# Altium project nnts.PrjPcb (part 2 of 3)

## Sheet USB.SchDoc: USB
size B; Revision: 1
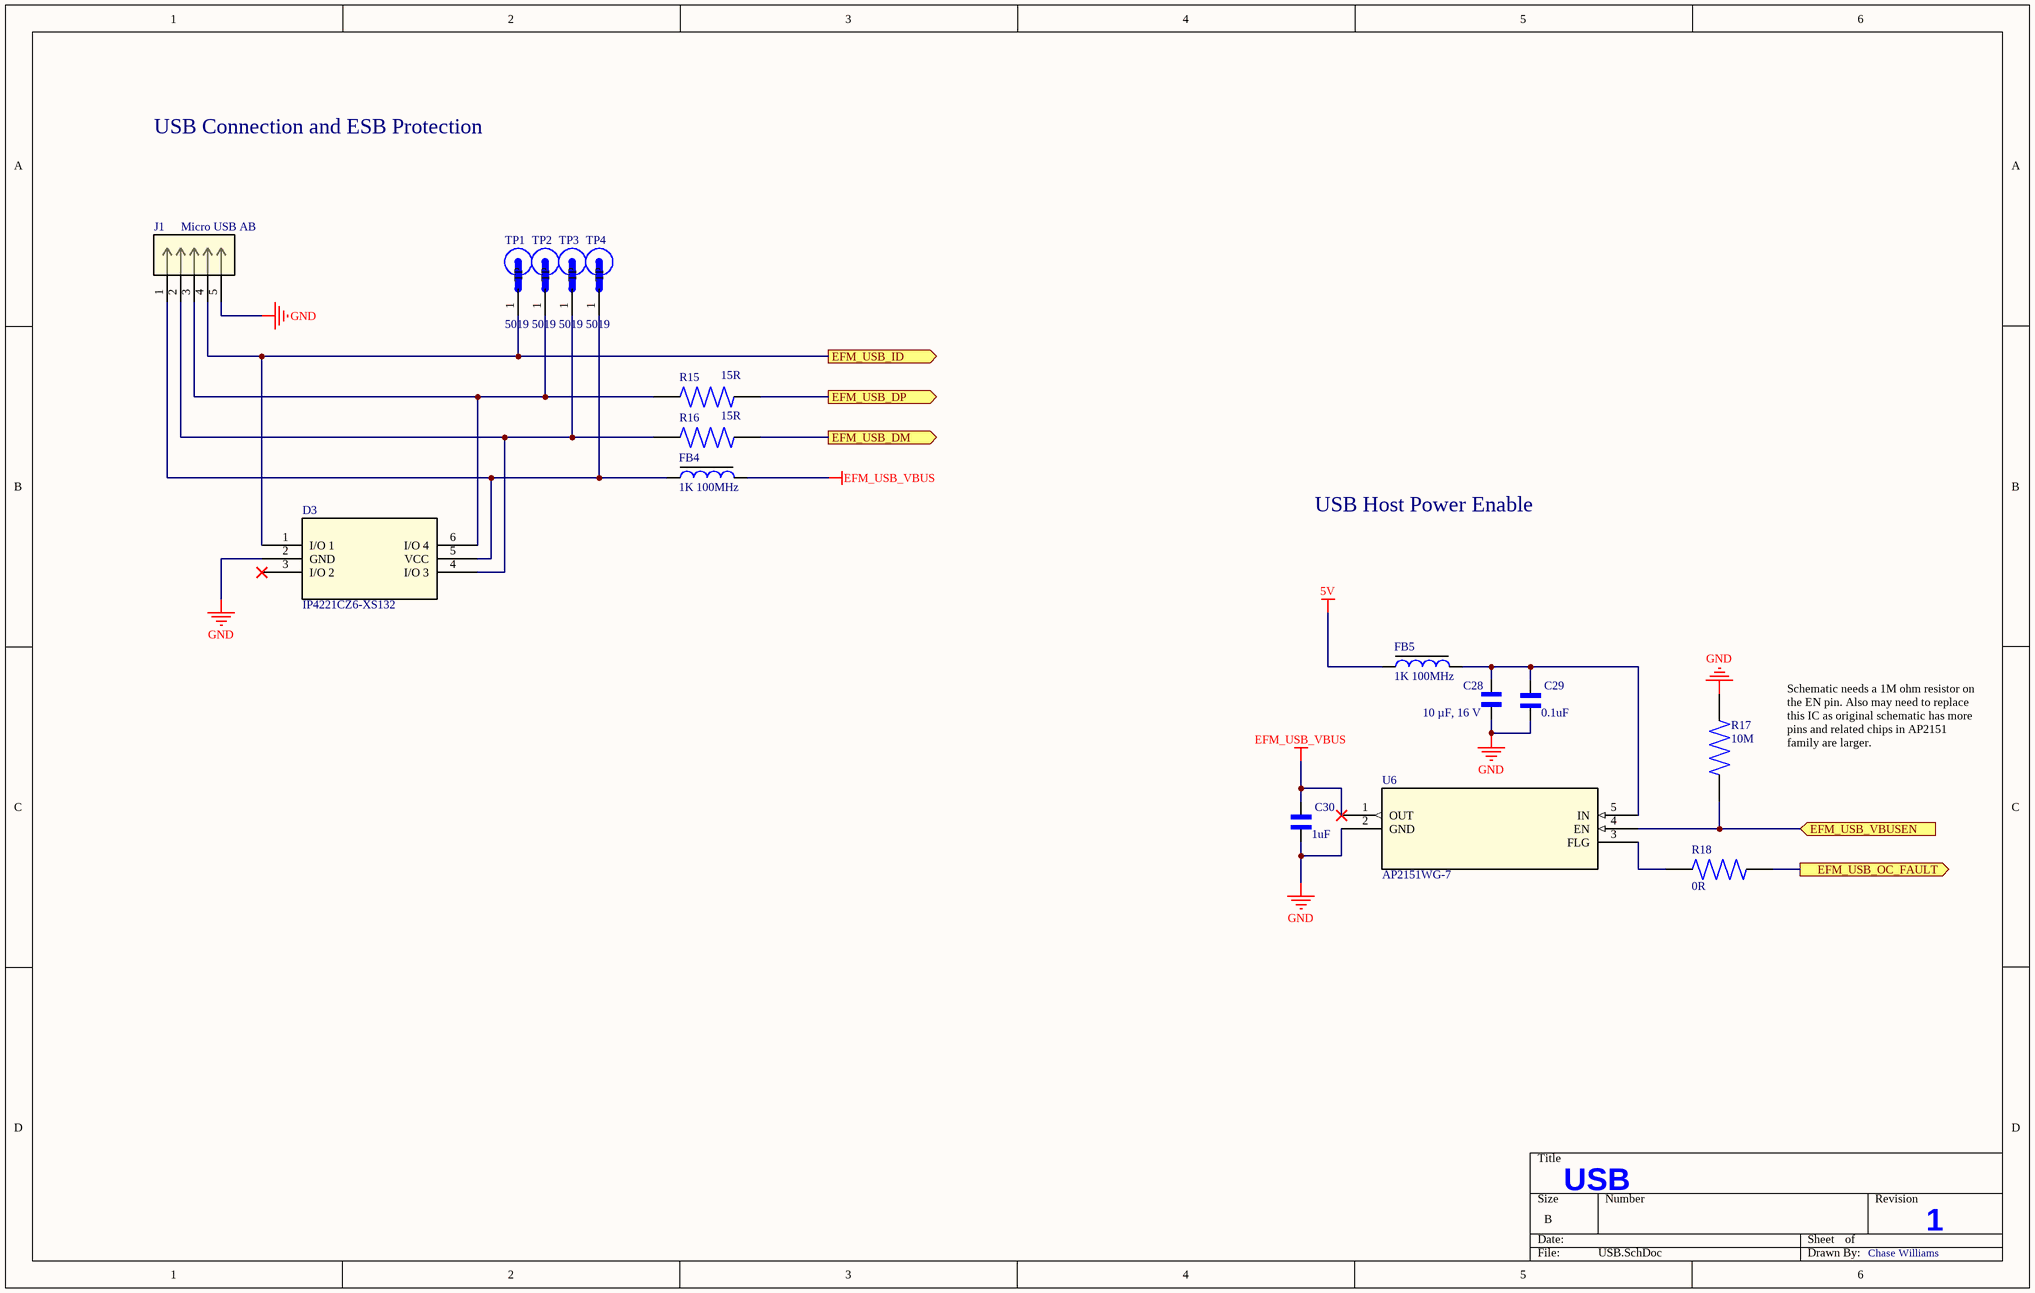
[diagram p5: USB.SchDoc]

### Parts
C28  10 µF, 16 V  [C0805]
C29  0.1uF  [C0402]
C30  1uF  [C0603]
D3  IP4221CZ6-XS132  [SOT886_NEX-M]
FB4  1K 100MHz  [FB0603]
FB5  1K 100MHz  [FB0603]
J1  Micro USB AB  [Molex Micro USB]
R15  15R  [R0402 Vishay]
R16  15R  [R0402 Vishay]
R17  10M  [R0402 Vishay]
R18  0R  [R0805 Yageo]
TP1  5019  [TP380X203]
TP2  5019  [TP380X203]
TP3  5019  [TP380X203]
TP4  5019  [TP380X203]
U6  AP2151WG-7  [AP2151FMG-7]

### Ports
EFM_USB_DM (out), EFM_USB_DP (out), EFM_USB_ID (out), EFM_USB_OC_FAULT (out), EFM_USB_VBUSEN (in)

### Nets
5V: FB5.1
EFM_USB_VBUS: C30.2 FB4.2 U6.1(OUT)  [project net EFM_BUS]
GND: C28.2 C29.1 C30.1 D3.2(GND) J1.5(GND) R17.2 U6.2(GND)
NetC28_1: C28.1 C29.2 FB5.2 U6.5(IN)
NetD3_1: D3.1(I/O_1) J1.4(ID) TP1.1(TP) ; port EFM_USB_ID
NetD3_4: D3.4(I/O_3) J1.2(D-) R16.1 TP3.1(TP)
NetD3_5: D3.5(VCC) FB4.1 J1.1(VBUS) TP4.1(TP)
NetD3_6: D3.6(I/O_4) J1.3(D+) R15.1 TP2.1(TP)
NetR15_2: R15.2 ; port EFM_USB_DP
NetR16_2: R16.2 ; port EFM_USB_DM
NetR17_1: R17.1 U6.4(EN) ; port EFM_USB_VBUSEN
NetR18_1: R18.1 U6.3(FLG)
NetR18_2: R18.2 ; port EFM_USB_OC_FAULT

Not connected (* = marked no-connect by the designer): D3 3(I/O_2)*

### Notes on the sheet
- USB Connection and ESB Protection
- USB Host Power Enable
- Schematic needs a 1M ohm resistor on the EN pin. Also may need to replace this IC as original schematic has more pins and related chips in AP2151 family are larger.
- Chase Williams

### Library data of the parts
C28 = C2012X5R1C106K085AC: TDK - C2012X5R1C106K085AC - SMD Multilayer Ceramic Capacitor, 10 µF, 16 V, 0805 [2012 Metric], ± 10%, X5R, C Series TDK; Capacitance: 10uF; Voltage Rating: 16V; Supplier 1: Digi-Key; Manufacturer: TDK; Manufacturer Part Number: C2012X5R1C106K085AC; RoHS: Yes; Category: Ceramic Capacitors; Stock 1: 1442350; Pricing 1: 1=0.25000, 10=0.17500, 100=0.09890, 500=0.06982, 1000=0.06110 (USD); Mount: Surface Mount; Case/Package: 0805; Number of Pins: 2; Weight: 0.000194oz; Case Code (Metric): 2012; Case Code (Imperial): 0805; Dielectric Material: Ceramic; Min Operating Temperature: -55°C; Max Operating Temperature: 85°C; Tolerance: 10%; Packaging: Tape and Reel; Voltage Rating (DC): 16V; Termination: SMD/SMT; Dielectric: X5R; Package Quantity: 1; Composition: Ceramic; Length: 2mm; Height: 0.85mm; Depth: 1.25mm; Width: 0.049inch; Thickness: 0.037inch; Lead Free: Lead Free; REACH SVHC: No SVHC; ComponentLink1URL: https://datasheet.ciiva.com/24218/c2012x5r1c106k085ac-264980-24218056.pdf?src-supplier=Mouser; ComponentLink1Description: https://datasheet.ciiva.com/24218/c2012x5r1c106k085ac-264980-24218056.pdf?src-supplier=Mouser; ComponentLink2URL: https://datasheet.ciiva.com/28451/1796654-28451610.pdf?src-supplier=Element14; ComponentLink2Description: https://datasheet.ciiva.com/28451/1796654-28451610.pdf?src-supplier=Element14; ComponentLink3URL: https://datasheet.ciiva.com/28602/1744655-28602170.pdf?src-supplier=Element14; ComponentLink3Description: https://datasheet.ciiva.com/28602/1744655-28602170.pdf?src-supplier=Element14; ComponentLink4URL: https://datasheet.ciiva.com/6259/tdkmlcccaprange-6259116.pdf?src-supplier=Digi-Key; ComponentLink4Description: https://datasheet.ciiva.com/6259/tdkmlcccaprange-6259116.pdf?src-supplier=Digi-Key; ComponentLink5URL: https://datasheet.ciiva.com/23803/1796654-23803020.pdf?src-supplier=Newark; ComponentLink5Description: https://datasheet.ciiva.com/23803/1796654-23803020.pdf?src-supplier=Newark; ComponentLink6URL: https://datasheet.ciiva.com/22719/1796654-22719549.pdf?src-supplier=Element14; ComponentLink6Description: https://datasheet.ciiva.com/22719/1796654-22719549.pdf?src-supplier=Element14; ComponentLink7URL: https://datasheet.ciiva.com/6259/tdkmlcccaprange-6259119.pdf?src-supplier=Digi-Key; ComponentLink7Description: https://datasheet.ciiva.com/6259/tdkmlcccaprange-6259119.pdf?src-supplier=Digi-Key; ComponentLink8URL: https://datasheet.ciiva.com/28673/mlcc-commercial-general-en-28673535.pdf?src-supplier=Element14; ComponentLink8Description: https://datasheet.ciiva.com/28673/mlcc-commercial-general-en-28673535.pdf?src-supplier=Element14; Supplier Part Number 1: 445-7644-1-ND
C29 = GRM022R60J104KE15L: CAP CER 0.1UF 6.3V X5R 01005; Manufacturer: Murata; Capacitance: 100nF; Tolerance: 10%; Supplier 1: Digi-Key; Manufacturer Part Number: GRM022R60J104KE15L; RoHS: No; Category: Ceramic Capacitors; Stock 1: 633064; Pricing 1: 1=0.13000, 10=0.09000, 50=0.05080, 100=0.04210, 500=0.02952, 1000=0.02444, 2500=0.02275, 5000=0.02081 (USD); Mount: Surface Mount; Case Code (Imperial): 1005; Case Code (Metric): 0402; Min Operating Temperature: -55°C; Max Operating Temperature: 85°C; Packaging: Cut Tape; Voltage Rating: 6.3V; ComponentLink1URL: http://search.murata.co.jp/Ceramy/image/img/A01X/G101/ENG/GRM022R60J104KE15-01.pdf?src-supplier=Digi-Key; ComponentLink1Description: http://search.murata.co.jp/Ceramy/image/img/A01X/G101/ENG/GRM022R60J104KE15-01.pdf?src-supplier=Digi-Key; Supplier Part Number 1: 490-16598-1-ND
C30 = CL10A105KO8NNNC: SAMSUNG ELECTRO-MECHANICS - CL10A105KO8NNNC - CAP, 1UF, 16V, MLCC, 0603; Material: Ceramic; Tolerance: 10%; Dielectric: X5R; Supplier 1: Digi-Key; Manufacturer: Samsung; Manufacturer Part Number: CL10A105KO8NNNC; RoHS: Yes; Category: Ceramic Capacitors; Stock 1: 1739627; Pricing 1: 1=0.10000, 10=0.03500, 50=0.01920, 100=0.01570, 500=0.01124, 1000=0.00883 (USD); Mount: Surface Mount; Case/Package: 0603; Case Code (Metric): 1608; Case Code (Imperial): 0603; Contact Plating: Tin; Min Operating Temperature: -55°C; Max Operating Temperature: 85°C; Capacitance: 1uF; Package Quantity: 1; Packaging: Tape and Reel; Voltage Rating: 16V; Voltage Rating (DC): 16V; Voltage: 16V; Length: 1.6mm; Width: 0.031inch; Height: 0.8mm; Thickness: 0.035inch; Depth: 0.8mm; Radiation Hardening: No; Lead Free: Lead Free; ComponentLink1URL: https://datasheet.ciiva.com/16199/cl10a105ko8nnnc-16199033.pdf?src-supplier=Future+Electronics; ComponentLink1Description: https://datasheet.ciiva.com/16199/cl10a105ko8nnnc-16199033.pdf?src-supplier=Future+Electronics; ComponentLink2URL: https://datasheet.ciiva.com/15195/getdatasheetpartid-359688-15195706.pdf?src-supplier=Verical; ComponentLink2Description: https://datasheet.ciiva.com/15195/getdatasheetpartid-359688-15195706.pdf?src-supplier=Verical; ComponentLink3URL: https://datasheet.ciiva.com/29198/458190-da-01-en-vs-kondensator-0603-29198480.pdf?src-supplier=Conrad; ComponentLink3Description: https://datasheet.ciiva.com/29198/458190-da-01-en-vs-kondensator-0603-29198480.pdf?src-supplier=Conrad; Supplier Part Number 1: 1276-1034-1-ND
D3 = IP4221CZ6-XS132: TVS DIODE 5.5VWM SOT891; Manufacturer: NXP Semiconductors; Number of Bidirectional Channels: 4; Reverse Standoff Voltage: 5.5V; Min Breakdown Voltage: 6V; Power Line Protection: Yes; Breakdown Voltage: 9V; Leakage Current: 100nA; Direction: Unidirectional; Capacitance: 1.2pF; Supplier 1: Digi-Key; Manufacturer Part Number: IP4221CZ6-XS132; RoHS: Yes; Category: ESD and Circuit Protection ICs; Mount: Surface Mount; Case/Package: DFN; Number of Pins: 6; Min Operating Temperature: -40°C; Max Operating Temperature: 85°C; Number of Channels: 4; Termination: SMD/SMT; Packaging: Tape and Reel; Package Quantity: 1; Length: 1.05mm; Depth: 1.05mm; Radiation Hardening: No; Lead Free: Lead Free; ComponentLink1URL: https://datasheet.ciiva.com/337/ip4221cz6-xs-337188.pdf?src-supplier=Digi-Key; ComponentLink1Description: https://datasheet.ciiva.com/337/ip4221cz6-xs-337188.pdf?src-supplier=Digi-Key; ComponentLink2URL: https://datasheet.ciiva.com/337/ip4221cz6-xs-337189.pdf?src-supplier=Digi-Key; ComponentLink2Description: https://datasheet.ciiva.com/337/ip4221cz6-xs-337189.pdf?src-supplier=Digi-Key; ComponentLink3URL: https://datasheet.ciiva.com/337/ip4221cz6-xs-337190.pdf?src-supplier=Digi-Key; ComponentLink3Description: https://datasheet.ciiva.com/337/ip4221cz6-xs-337190.pdf?src-supplier=Digi-Key; Supplier Part Number 1: 568-6341-2-ND
FB4 FB5 = 742792662: Ferrite Beads Multi-Layer Chip Bead 1KOhm 25% 100MHz 600mA 0603 T/R; Manufacturer: Wurth Electronics; Impedance: 1kR; Number of Lines: 1; DC Resistance (DCR): 300mR; Test Frequency: 120MHz; Supplier 1: Digi-Key; Manufacturer Part Number: 742792662; RoHS: Yes; Category: Ferrite Beads and Chips; Stock 1: 96964; Pricing 1: 1=0.17000, 50=0.16800, 100=0.15500, 500=0.14800, 1000=0.14100, 2000=0.13400 (USD); Mount: Surface Mount; Case/Package: SMD/SMT; Case Code (Metric): 1608; Case Code (Imperial): 0603; Weight: 7.1E-05oz; Material: Ferrite; Min Operating Temperature: -55°C; Max Operating Temperature: 125°C; Package Quantity: 4000; Packaging: Tape and Reel; Tolerance: 25%; Max Current Rating: 600mA; Max DC Current: 600mA; Termination: SMD/SMT; Length: 1.6mm; Width: 0.031inch; Height: 0.8mm; Depth: 0.8mm; Lead Free: Lead Free; ComponentLink1URL: https://datasheet.ciiva.com/29364/742792662-29364469.pdf?src-supplier=Digi-Key; ComponentLink1Description: https://datasheet.ciiva.com/29364/742792662-29364469.pdf?src-supplier=Digi-Key; ComponentLink2URL: https://datasheet.ciiva.com/30489/0900766b812a6756-30489145.pdf?src-supplier=RSComponents; ComponentLink2Description: https://datasheet.ciiva.com/30489/0900766b812a6756-30489145.pdf?src-supplier=RSComponents; ComponentLink3URL: https://datasheet.ciiva.com/29364/742792662-29364471.pdf?src-supplier=Digi-Key; ComponentLink3Description: https://datasheet.ciiva.com/29364/742792662-29364471.pdf?src-supplier=Digi-Key; ComponentLink4URL: https://datasheet.ciiva.com/29364/742792662-29364473.pdf?src-supplier=Digi-Key; ComponentLink4Description: https://datasheet.ciiva.com/29364/742792662-29364473.pdf?src-supplier=Digi-Key; Supplier Part Number 1: 732-4670-1-ND
J1 = Molex Micro USB: https://www.molex.com/molex/products/part-detail/io_connectors/0475890001; Manufacturer_Part_Number: 47589-0001; Vendor: Molex Connector Corporation; Built_By: EMA_Don; SourceLibrary: Molex_2018-12-15; Copyright: Copyright (C) 2016 Accelerated Designs. All rights reserved; RefDes: RefDes; Type: DEV
R15 R16 = CRCW040215R0FKED: VISHAY - CRCW040215R0FKED - SMD Chip Resistor, 0402 [1005 Metric], 15 ohm, CRCW e3 Series, 50 V, Thick Film, 63 mW; Tolerance: 1%; Temperature Coefficient: 100ppm/°C; Power Rating: 63mW; Voltage Rating: 50V; Supplier 1: Digi-Key; Manufacturer: Vishay; Manufacturer Part Number: CRCW040215R0FKED; RoHS: Yes; Category: Chip SMD Resistors; Stock 1: 18; Pricing 1: 1=0.10000, 10=0.03300, 100=0.01330, 1000=0.00596, 2500=0.00518, 5000=0.00428 (USD); Case/Package: 0402; Contact Plating: Tin; Case Code (Imperial): 0402; Case Code (Metric): 1005; Weight: 2.3E-05oz; Min Operating Temperature: -55°C; Max Operating Temperature: 155°C; Resistance: 15R; Resistor Type: Thick Film; Packaging: Tape and Reel; Package Quantity: 10; Termination: SMD/SMT; Number of Terminations: 2; Max Power Dissipation: 63mW; Voltage Rating (DC): 50V; Features: Automotive AEC-Q200; Length: 1mm; Width: 0.5mm; Height: 0.35mm; Depth: 0.5mm; Radiation Hardening: No; REACH SVHC: Unknown; Lead Free: Lead Free; Military Standard: Not; ComponentLink1URL: https://datasheet.ciiva.com/11812/0900766b80d98824-11812193.pdf?src-supplier=RSComponents; ComponentLink1Description: https://datasheet.ciiva.com/11812/0900766b80d98824-11812193.pdf?src-supplier=RSComponents; ComponentLink2URL: https://datasheet.ciiva.com/5550/dcrcwe3-109170-5550213.pdf?src-supplier=Mouser; ComponentLink2Description: https://datasheet.ciiva.com/5550/dcrcwe3-109170-5550213.pdf?src-supplier=Mouser; ComponentLink3URL: https://datasheet.ciiva.com/2463/dcrcwe3-2463641.pdf?src-supplier=Digi-Key; ComponentLink3Description: https://datasheet.ciiva.com/2463/dcrcwe3-2463641.pdf?src-supplier=Digi-Key; ComponentLink4URL: https://datasheet.ciiva.com/2463/dcrcwe3-2463642.pdf?src-supplier=Digi-Key; ComponentLink4Description: https://datasheet.ciiva.com/2463/dcrcwe3-2463642.pdf?src-supplier=Digi-Key; ComponentLink5URL: https://datasheet.ciiva.com/16778/70201119-16778045.pdf?src-supplier=Allied+Electronics; ComponentLink5Description: https://datasheet.ciiva.com/16778/70201119-16778045.pdf?src-supplier=Allied+Electronics; ComponentLink6URL: https://datasheet.ciiva.com/7777/1697337-7777205.pdf?src-supplier=Element14; ComponentLink6Description: https://datasheet.ciiva.com/7777/1697337-7777205.pdf?src-supplier=Element14; ComponentLink7URL: https://datasheet.ciiva.com/2463/dcrcwe3-2463640.pdf?src-supplier=Digi-Key; ComponentLink7Description: https://datasheet.ciiva.com/2463/dcrcwe3-2463640.pdf?src-supplier=Digi-Key; ComponentLink8URL: https://datasheet.ciiva.com/26316/fld-crcw-e3-data-en-26316664.pdf?src-supplier=Distrelec; ComponentLink8Description: https://datasheet.ciiva.com/26316/fld-crcw-e3-data-en-26316664.pdf?src-supplier=Distrelec; ComponentLink9URL: https://datasheet.ciiva.com/16880/dcrcwe3-16880876.pdf?src-supplier=Avnet+Europe; ComponentLink9Description: https://datasheet.ciiva.com/16880/dcrcwe3-16880876.pdf?src-supplier=Avnet+Europe; ComponentLink10URL: https://datasheet.ciiva.com/22869/70201119-22869118.pdf?src-supplier=Allied+Electronics; ComponentLink10Description: https://datasheet.ciiva.com/22869/70201119-22869118.pdf?src-supplier=Allied+Electronics; ComponentLink11URL: https://datasheet.ciiva.com/16393/dcrcwe3-16393535.pdf?src-supplier=Future+Electronics; ComponentLink11Description: https://datasheet.ciiva.com/16393/dcrcwe3-16393535.pdf?src-supplier=Future+Electronics; ComponentLink12URL: https://datasheet.ciiva.com/22740/1533075-22740367.pdf?src-supplier=Element14; ComponentLink12Description: https://datasheet.ciiva.com/22740/1533075-22740367.pdf?src-supplier=Element14; Supplier Part Number 1: 541-15.0LCT-ND
R17 = CRCW040210M0FKED: RESISTOR, 0402, 10M, 1%, FULL REEL; Product Range:VISHAY - AEC-Q200 CRCW Series; Resistance:10Mohm; Power Rating:63mW; Resistance Tolerance:± 1%; Resistor Case Style:0402 [1005 Metric]; Resistor Element Material:Thick Film; ;RoHS Compliant: Yes; Manufacturer: Vishay; Resistance: 10MR; Temperature Coefficient: 100ppm/°C; Max Power Dissipation: 63mW; Voltage Rating: 50V; Supplier 1: Digi-Key; Manufacturer Part Number: CRCW040210M0FKED; RoHS: Yes; Category: Chip SMD Resistors; Stock 1: 167645; Pricing 1: 1=0.10000, 10=0.03300, 100=0.01330, 1000=0.00596, 2500=0.00518, 5000=0.00428 (USD); Mount: Surface Mount; Case/Package: 0402; Case Code (Metric): 1005; Case Code (Imperial): 0402; Weight: 2.3E-05oz; Contact Plating: Tin; Min Operating Temperature: -55°C; Max Operating Temperature: 155°C; Resistor Type: Thick Film; Tolerance: 1%; Packaging: Tape and Reel; Number of Terminations: 2; Power Rating: 63mW; Package Quantity: 10; Termination: SMD/SMT; Voltage Rating (DC): 50V; Features: Automotive AEC-Q200; Length: 1mm; Width: 0.02inch; Height: 0.35mm; Depth: 0.5mm; Radiation Hardening: No; REACH SVHC: Unknown; Military Standard: Not; Lead Free: Lead Free; ComponentLink1URL: https://datasheet.ciiva.com/11811/0900766b80d98824-11811586.pdf?src-supplier=RSComponents; ComponentLink1Description: https://datasheet.ciiva.com/11811/0900766b80d98824-11811586.pdf?src-supplier=RSComponents; ComponentLink2URL: https://datasheet.ciiva.com/2463/dcrcwe3-2463089.pdf?src-supplier=Digi-Key; ComponentLink2Description: https://datasheet.ciiva.com/2463/dcrcwe3-2463089.pdf?src-supplier=Digi-Key; ComponentLink3URL: https://datasheet.ciiva.com/2463/dcrcwe3-2463088.pdf?src-supplier=Digi-Key; ComponentLink3Description: https://datasheet.ciiva.com/2463/dcrcwe3-2463088.pdf?src-supplier=Digi-Key; ComponentLink4URL: https://datasheet.ciiva.com/2463/dcrcwe3-2463090.pdf?src-supplier=Digi-Key; ComponentLink4Description: https://datasheet.ciiva.com/2463/dcrcwe3-2463090.pdf?src-supplier=Digi-Key; ComponentLink5URL: https://datasheet.ciiva.com/5552/dcrcwe3-109170-5552597.pdf?src-supplier=Mouser; ComponentLink5Description: https://datasheet.ciiva.com/5552/dcrcwe3-109170-5552597.pdf?src-supplier=Mouser; ComponentLink6URL: https://datasheet.ciiva.com/16881/dcrcwe3-16881451.pdf?src-supplier=Avnet+Europe; ComponentLink6Description: https://datasheet.ciiva.com/16881/dcrcwe3-16881451.pdf?src-supplier=Avnet+Europe; ComponentLink7URL: https://datasheet.ciiva.com/26316/fld-crcw-e3-data-en-26316614.pdf?src-supplier=Distrelec; ComponentLink7Description: https://datasheet.ciiva.com/26316/fld-crcw-e3-data-en-26316614.pdf?src-supplier=Distrelec; ComponentLink8URL: https://datasheet.ciiva.com/16773/70201119-16773258.pdf?src-supplier=Allied+Electronics; ComponentLink8Description: https://datasheet.ciiva.com/16773/70201119-16773258.pdf?src-supplier=Allied+Electronics; Supplier Part Number 1: 541-10.0MLCT-ND
R18 = RC0805JR-070RL: Surface Mount Thick Film Resistor, RC Series, 125 mW, - 5%, 150 V, 0805 [2012 Metric]; Manufacturer: Yageo; Resistance: 0mR; Power Rating: 125mW; Voltage Rating: 150V; Temperature Coefficient: 200ppm/°C; Supplier 1: Digi-Key; Manufacturer Part Number: RC0805JR-070RL; RoHS: Yes; Category: Chip SMD Resistors; Stock 1: 7454053; Pricing 1: 1=0.10000, 10=0.03500, 25=0.02480, 50=0.01900, 100=0.01400, 250=0.01072, 500=0.00856, 1000=0.00631 (USD); Case/Package: 0805; Number of Pins: 2; Contact Plating: Tin,Matte; Case Code (Imperial): 0805; Case Code (Metric): 2012; Min Operating Temperature: -55°C; Max Operating Temperature: 155°C; Composition: Thick Film; Tolerance: 5%; Packaging: Tape and Reel; Voltage Rating (DC): 150V; Termination: SMD/SMT; Military Standard: Not; Length: 2mm; Height: 0.5mm; Width: 1.25mm; Depth: 1.25mm; Radiation Hardening: No; REACH SVHC: Unknown; Lead Free: Lead Free; ComponentLink1URL: https://datasheet.ciiva.com/7941/1738694-7941861.pdf?src-supplier=Element14; ComponentLink1Description: https://datasheet.ciiva.com/7941/1738694-7941861.pdf?src-supplier=Element14; ComponentLink2URL: https://datasheet.ciiva.com/11819/0900766b8106beab-11819430.pdf?src-supplier=RSComponents; ComponentLink2Description: https://datasheet.ciiva.com/11819/0900766b8106beab-11819430.pdf?src-supplier=RSComponents; ComponentLink3URL: https://datasheet.ciiva.com/7941/1738694-7941862.pdf?src-supplier=Element14; ComponentLink3Description: https://datasheet.ciiva.com/7941/1738694-7941862.pdf?src-supplier=Element14; ComponentLink4URL: https://datasheet.ciiva.com/7941/1738694-7941863.pdf?src-supplier=Element14; ComponentLink4Description: https://datasheet.ciiva.com/7941/1738694-7941863.pdf?src-supplier=Element14; ComponentLink5URL: https://datasheet.ciiva.com/15190/getdatasheetpartid-330685-15190028.pdf?src-supplier=Verical; ComponentLink5Description: https://datasheet.ciiva.com/15190/getdatasheetpartid-330685-15190028.pdf?src-supplier=Verical; Supplier Part Number 1: 311-0.0ARCT-ND
TP1-TP4 = 5019: PC Test Point, Miniature Phosphor Bronze, Silver Plating Surface Mount Mounting Type; MF: Keystone Electronics; Value: *; MP: 5019; Package: 2010 Keystone; SnapEDA_Link: https://www.snapeda.com/parts/5019/Keystone%20Electronics/view-part/449144/?ref=snap; Digi-Key_Part_Number: 36-5019CT-ND; Digi-Key_Purchase_URL: https://www.digikey.com/product-detail/en/keystone-electronics/5019/36-5019CT-ND/3907344?utm_source=snapeda&utm_medium=aggregator&utm_campaign=symbol
U6 = AP2151WG-7: U400; Vendor: Diodes Inc; Built_By: EMA_UL_Team; SourceLibrary: DIODESINC_2_2015-08-18; Manufacturer_Part_Number: AP2151WG-7; Copyright: Copyright (C) 2018 Accelerated Designs. All rights reserved; RefDes: RefDes; Type: DEV

## Sheet Power.SchDoc: 3V3 Voltage Regulator
size A; Revision: 1
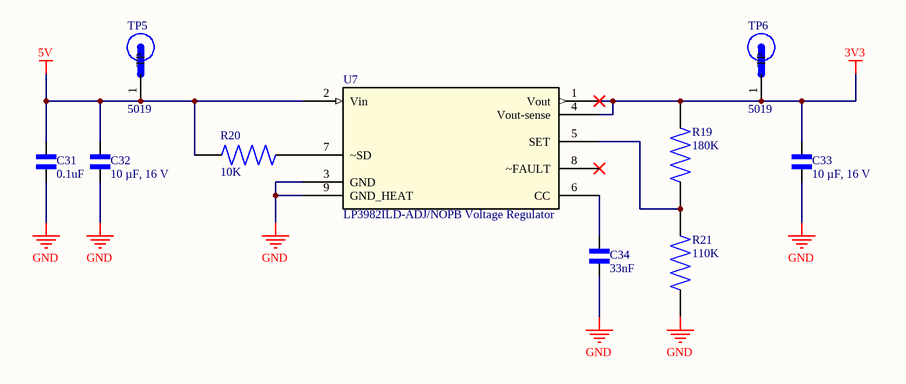
[diagram p6: Power.SchDoc]

### Parts
C31  0.1uF  [C0402]
C32  10 µF, 16 V  [C0805]
C33  10 µF, 16 V  [C0805]
C34  33nF  [C0402]
R19  180K  [R0603 Vishay]
R20  10K  [R0603 Vishay]
R21  110K  [R0603 Vishay]
TP5  5019  [TP380X203]
TP6  5019  [TP380X203]
U7  LP3982ILD-ADJ/NOPB Voltage Regulator  [LP3982ILD-ADJ]

### Nets
3V3: C33.2 R19.2 TP6.1(TP) U7.1(Vout) U7.4(Vout-sense)
5V: C31.2 C32.2 R20.1 TP5.1(TP) U7.2(Vin)
GND: C31.1 C32.1 C33.1 C34.1 R21.1 U7.3(GND) U7.9(GND_HEAT)
NetC34_2: C34.2 U7.6(CC)
NetR19_1: R19.1 R21.2 U7.5(SET)
NetR20_2: R20.2 U7.7(~SD)

Not connected (* = marked no-connect by the designer): U7 8(~FAULT)*

### Library data of the parts
C31 = GRM022R60J104KE15L: as C29 on sheet USB; Supplier 1: Digi-Key; Manufacturer Part Number: GRM022R60J104KE15L; RoHS: No; Category: Ceramic Capacitors; Stock 1: 633064; Pricing 1: 1=0.13000, 10=0.09000, 50=0.05080, 100=0.04210, 500=0.02952, 1000=0.02444, 2500=0.02275, 5000=0.02081 (USD); Mount: Surface Mount; Case Code (Imperial): 1005; Case Code (Metric): 0402; Min Operating Temperature: -55°C; Max Operating Temperature: 85°C; Packaging: Cut Tape; Voltage Rating: 6.3V; ComponentLink1URL: http://search.murata.co.jp/Ceramy/image/img/A01X/G101/ENG/GRM022R60J104KE15-01.pdf?src-supplier=Digi-Key; ComponentLink1Description: http://search.murata.co.jp/Ceramy/image/img/A01X/G101/ENG/GRM022R60J104KE15-01.pdf?src-supplier=Digi-Key; Supplier Part Number 1: 490-16598-1-ND
C32 C33 = C2012X5R1C106K085AC: as C28 on sheet USB; Supplier 1: Digi-Key; Manufacturer: TDK; Manufacturer Part Number: C2012X5R1C106K085AC; RoHS: Yes; Category: Ceramic Capacitors; Stock 1: 1442350; Pricing 1: 1=0.25000, 10=0.17500, 100=0.09890, 500=0.06982, 1000=0.06110 (USD); Mount: Surface Mount; Case/Package: 0805; Number of Pins: 2; Weight: 0.000194oz; Case Code (Metric): 2012; Case Code (Imperial): 0805; Dielectric Material: Ceramic; Min Operating Temperature: -55°C; Max Operating Temperature: 85°C; Tolerance: 10%; Packaging: Tape and Reel; Voltage Rating (DC): 16V; Termination: SMD/SMT; Dielectric: X5R; Package Quantity: 1; Composition: Ceramic; Length: 2mm; Height: 0.85mm; Depth: 1.25mm; Width: 0.049inch; Thickness: 0.037inch; Lead Free: Lead Free; REACH SVHC: No SVHC; ComponentLink1URL: https://datasheet.ciiva.com/24218/c2012x5r1c106k085ac-264980-24218056.pdf?src-supplier=Mouser; ComponentLink1Description: https://datasheet.ciiva.com/24218/c2012x5r1c106k085ac-264980-24218056.pdf?src-supplier=Mouser; ComponentLink2URL: https://datasheet.ciiva.com/28451/1796654-28451610.pdf?src-supplier=Element14; ComponentLink2Description: https://datasheet.ciiva.com/28451/1796654-28451610.pdf?src-supplier=Element14; ComponentLink3URL: https://datasheet.ciiva.com/28602/1744655-28602170.pdf?src-supplier=Element14; ComponentLink3Description: https://datasheet.ciiva.com/28602/1744655-28602170.pdf?src-supplier=Element14; ComponentLink4URL: https://datasheet.ciiva.com/6259/tdkmlcccaprange-6259116.pdf?src-supplier=Digi-Key; ComponentLink4Description: https://datasheet.ciiva.com/6259/tdkmlcccaprange-6259116.pdf?src-supplier=Digi-Key; ComponentLink5URL: https://datasheet.ciiva.com/23803/1796654-23803020.pdf?src-supplier=Newark; ComponentLink5Description: https://datasheet.ciiva.com/23803/1796654-23803020.pdf?src-supplier=Newark; ComponentLink6URL: https://datasheet.ciiva.com/22719/1796654-22719549.pdf?src-supplier=Element14; ComponentLink6Description: https://datasheet.ciiva.com/22719/1796654-22719549.pdf?src-supplier=Element14; ComponentLink7URL: https://datasheet.ciiva.com/6259/tdkmlcccaprange-6259119.pdf?src-supplier=Digi-Key; ComponentLink7Description: https://datasheet.ciiva.com/6259/tdkmlcccaprange-6259119.pdf?src-supplier=Digi-Key; ComponentLink8URL: https://datasheet.ciiva.com/28673/mlcc-commercial-general-en-28673535.pdf?src-supplier=Element14; ComponentLink8Description: https://datasheet.ciiva.com/28673/mlcc-commercial-general-en-28673535.pdf?src-supplier=Element14; Supplier Part Number 1: 445-7644-1-ND
C34 = CM02X5R333K06AH: Multilayer Ceramic Capacitors MLCC - SMD/SMT 6.3V 0.033uF X5R 01005 10%; Manufacturer: Kyocera AVX; Supplier 1: Digi-Key; Manufacturer Part Number: CM02X5R333K06AH; RoHS: No; Stock 1: 20000; Pricing 1: 1=0.10000, 10=0.04800, 50=0.02640, 100=0.02160, 500=0.01540, 1000=0.01210, 2500=0.01100, 5000=0.01012 (USD); Supplier Part Number 1: 1253-CM02X5R333K06AHCT-ND
R19 = CRCW0201180KFNED: VISHAY - CRCW0201180KFNED - SMD Chip Resistor, 0201 [0603 Metric], 180 kohm, CRCW e3 Series, 30 V, Thick Film, 50 mW; Resistance: 180kR; Power Rating: 50mW; Tolerance: 1%; Voltage Rating: 30V; Temperature Coefficient: 200ppm/°C; Supplier 1: Digi-Key; Manufacturer: Vishay; Manufacturer Part Number: CRCW0201180KFNED; RoHS: Yes; Category: Chip SMD Resistors; Stock 1: 10120; Pricing 1: 1=0.10000, 10=0.05700, 100=0.02300, 1000=0.01034, 2500=0.00897, 5000=0.00741 (USD); Case/Package: 0201; Case Code (Metric): 0603; Case Code (Imperial): 0201; Contact Plating: Tin; Min Operating Temperature: -55°C; Max Operating Temperature: 155°C; Packaging: Tape and Reel; Resistor Type: Thick Film; Voltage Rating (DC): 30V; Length: 600um; Width: 300um; Height: 230um; Radiation Hardening: No; REACH SVHC: Unknown; Lead Free: Lead Free; ComponentLink1URL: https://datasheet.ciiva.com/22665/1700795-22665798.pdf?src-supplier=Element14; ComponentLink1Description: https://datasheet.ciiva.com/22665/1700795-22665798.pdf?src-supplier=Element14; ComponentLink2URL: https://datasheet.ciiva.com/22692/1719906-22692745.pdf?src-supplier=Element14; ComponentLink2Description: https://datasheet.ciiva.com/22692/1719906-22692745.pdf?src-supplier=Element14; ComponentLink3URL: https://datasheet.ciiva.com/7714/1719906-7714127.pdf?src-supplier=Element14; ComponentLink3Description: https://datasheet.ciiva.com/7714/1719906-7714127.pdf?src-supplier=Element14; Supplier Part Number 1: 541-CRCW0201180KFNEDCT-ND
R20 = CRCW020110K0FNED: VISHAY - CRCW020110K0FNED. - Surface Mount Thick Film Resistor, AEC-Q200 CRCW Series, 10 kohm, 50 mW, -  1%, 30 V RoHS Compliant: Yes; Resistance: 10kR; Power Rating: 50mW; Voltage Rating: 30V; Temperature Coefficient: 200ppm/°C; Supplier 1: Digi-Key; Manufacturer: Vishay; Manufacturer Part Number: CRCW020110K0FNED; RoHS: Yes; Category: Chip SMD Resistors; Stock 1: 567966; Pricing 1: 1=0.10000, 10=0.05700, 100=0.02300, 1000=0.01034, 2500=0.00897, 5000=0.00741 (USD); Mount: Surface Mount; Case/Package: 0201; Number of Pins: 2; Weight: 6E-06oz; Case Code (Imperial): 0201; Case Code (Metric): 0603; Contact Plating: Tin; Min Operating Temperature: -55°C; Max Operating Temperature: 155°C; Tolerance: 1%; Packaging: Tape and Reel; Package Quantity: 1; Termination: SMD/SMT; Resistor Type: Thick Film; Number of Terminations: 2; Max Power Dissipation: 50mW; Voltage Rating (DC): 30V; Length: 0.6mm; Width: 0.3mm; Height: 0.011inch; Depth: 0.3mm; Radiation Hardening: No; REACH SVHC: Unknown; Military Standard: Not; Lead Free: Lead Free; ComponentLink1URL: https://datasheet.ciiva.com/2474/crcw0201e3-2474818.pdf?src-supplier=Digi-Key; ComponentLink1Description: https://datasheet.ciiva.com/2474/crcw0201e3-2474818.pdf?src-supplier=Digi-Key; ComponentLink2URL: https://datasheet.ciiva.com/7983/1719906-7983320.pdf?src-supplier=Element14; ComponentLink2Description: https://datasheet.ciiva.com/7983/1719906-7983320.pdf?src-supplier=Element14; ComponentLink3URL: https://datasheet.ciiva.com/16436/dcrcwe3-16436222.pdf?src-supplier=Future+Electronics; ComponentLink3Description: https://datasheet.ciiva.com/16436/dcrcwe3-16436222.pdf?src-supplier=Future+Electronics; ComponentLink4URL: https://datasheet.ciiva.com/2474/crcw0201e3-2474819.pdf?src-supplier=Digi-Key; ComponentLink4Description: https://datasheet.ciiva.com/2474/crcw0201e3-2474819.pdf?src-supplier=Digi-Key; ComponentLink5URL: https://datasheet.ciiva.com/2474/crcw0201e3-2474820.pdf?src-supplier=Digi-Key; ComponentLink5Description: https://datasheet.ciiva.com/2474/crcw0201e3-2474820.pdf?src-supplier=Digi-Key; ComponentLink6URL: https://datasheet.ciiva.com/22692/1719906-22692709.pdf?src-supplier=Element14; ComponentLink6Description: https://datasheet.ciiva.com/22692/1719906-22692709.pdf?src-supplier=Element14; ComponentLink7URL: https://datasheet.ciiva.com/7983/1719906-7983319.pdf?src-supplier=Element14; ComponentLink7Description: https://datasheet.ciiva.com/7983/1719906-7983319.pdf?src-supplier=Element14; ComponentLink8URL: https://datasheet.ciiva.com/22868/70202042-22868839.pdf?src-supplier=Allied+Electronics; ComponentLink8Description: https://datasheet.ciiva.com/22868/70202042-22868839.pdf?src-supplier=Allied+Electronics; Supplier Part Number 1: 541-10.0KABCT-ND
R21 = CRCW0201110KFNED: RES SMD 110K OHM 1% 1/20W 0201; Manufacturer: Vishay; Resistance: 110kR; Power Rating: 50mW; Voltage Rating: 30V; Temperature Coefficient: 200ppm/°C; Supplier 1: Digi-Key; Manufacturer Part Number: CRCW0201110KFNED; RoHS: Yes; Category: Chip SMD Resistors; Stock 1: 6456; Pricing 1: 1=0.10000, 10=0.05700, 100=0.02300, 1000=0.01034, 2500=0.00897, 5000=0.00741 (USD); Case/Package: 0201; Case Code (Metric): 0603; Case Code (Imperial): 0201; Contact Plating: Tin; Min Operating Temperature: -55°C; Max Operating Temperature: 155°C; Package Quantity: 10000; Tolerance: 1%; Packaging: Tape and Reel; Resistor Type: Thick Film; Number of Terminations: 2; Max Power Dissipation: 50mW; Voltage Rating (DC): 30V; Length: 0.024inch; Width: 0.012inch; Height: 0.011inch; Radiation Hardening: No; REACH SVHC: Unknown; Lead Free: Lead Free; ComponentLink1URL: https://datasheet.ciiva.com/8977/crcw0201e3-8977608.pdf?src-supplier=Avnet; ComponentLink1Description: https://datasheet.ciiva.com/8977/crcw0201e3-8977608.pdf?src-supplier=Avnet; ComponentLink2URL: https://datasheet.ciiva.com/22692/1719906-22692712.pdf?src-supplier=Element14; ComponentLink2Description: https://datasheet.ciiva.com/22692/1719906-22692712.pdf?src-supplier=Element14; ComponentLink3URL: https://datasheet.ciiva.com/2577/crcw0201e3-2577313.pdf?src-supplier=Digi-Key; ComponentLink3Description: https://datasheet.ciiva.com/2577/crcw0201e3-2577313.pdf?src-supplier=Digi-Key; ComponentLink4URL: https://datasheet.ciiva.com/22665/1700795-22665706.pdf?src-supplier=Element14; ComponentLink4Description: https://datasheet.ciiva.com/22665/1700795-22665706.pdf?src-supplier=Element14; Supplier Part Number 1: 541-CRCW0201110KFNEDCT-ND
TP5 TP6 = 5019: as TP1 on sheet USB; Value: *; MP: 5019; Package: 2010 Keystone; SnapEDA_Link: https://www.snapeda.com/parts/5019/Keystone%20Electronics/view-part/449144/?ref=snap; Digi-Key_Part_Number: 36-5019CT-ND; Digi-Key_Purchase_URL: https://www.digikey.com/product-detail/en/keystone-electronics/5019/36-5019CT-ND/3907344?utm_source=snapeda&utm_medium=aggregator&utm_campaign=symbol
U7 = LP3982ILD-ADJ: https://www.ti.com/product/LP3982?HQS=TI-null-null-octopart-df-pf-null-wwe; Vendor: Texas Instruments; Built_By: EMA_UL_Team; SourceLibrary: TI_2019-03-28; Manufacturer_Part_Number: LP3982ILD-ADJ/NOPB; Copyright: Copyright (C) 2018 Accelerated Designs. All rights reserved; RefDes: RefDes; Type: DEV

## Sheet EXP_Headers.SchDoc: EXP Headers
size A; Revision: 1
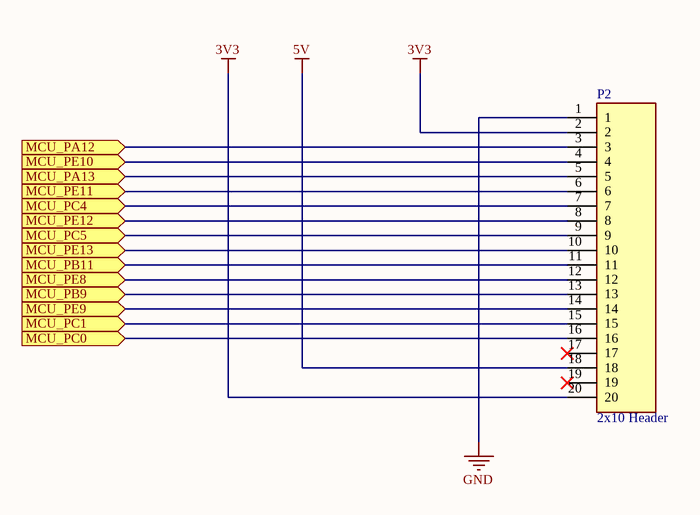
[diagram p7: EXP_Headers.SchDoc]

### Parts
P2  2x10 Header  [2x10 Header]

### Ports
MCU_PA12 (in), MCU_PA13 (in), MCU_PB9 (in), MCU_PB11 (in), MCU_PC0 (in), MCU_PC1 (in), MCU_PC4 (in), MCU_PC5 (in), MCU_PE8 (in), MCU_PE9 (in), MCU_PE10 (in), MCU_PE11 (in), MCU_PE12 (in), MCU_PE13 (in)

### Nets
3V3: P2.2 P2.20
5V: P2.18
GND: P2.1
NetP2_3: P2.3 ; port MCU_PA12
NetP2_4: P2.4 ; port MCU_PE10
NetP2_5: P2.5 ; port MCU_PA13
NetP2_6: P2.6 ; port MCU_PE11
NetP2_7: P2.7 ; port MCU_PC4
NetP2_8: P2.8 ; port MCU_PE12
NetP2_9: P2.9 ; port MCU_PC5
NetP2_10: P2.10 ; port MCU_PE13
NetP2_11: P2.11 ; port MCU_PB11
NetP2_12: P2.12 ; port MCU_PE8
NetP2_13: P2.13 ; port MCU_PB9
NetP2_14: P2.14 ; port MCU_PE9
NetP2_15: P2.15 ; port MCU_PC1
NetP2_16: P2.16 ; port MCU_PC0

Not connected (* = marked no-connect by the designer): P2 17* 19*

### Library data of the parts
P2 = 2x10 Header: HE2P-20G6C394-5R, 2.54 mm pegs.; MP: 1-826944-0; Number_of_Positions: 20; Product_Type: Connector; MF: TE Connectivity; Centerline_Pitch: 2.54 mm[.1 in]; Package: None; TE_purchase_URL: https://www.te.com/usa-en/product-1-826944-0.html?te_bu=Cor&te_type=disp&te_campaign=seda_glo_cor-seda-global-disp-prtnr-fy19-seda-model-bom-cta_sma-317_1&elqCampaignId=32493; Price: None; EU_RoHS_Compliance: Compliant; Value: *; SnapEDA_Link: https://www.snapeda.com/parts/1-826944-0/TE%20Connectivity%20AMP%20Connectors/view-part/517829/?ref=snap; Availability: Unavailable

## Sheet LED.SchDoc: LEDs
size A; Revision: 1
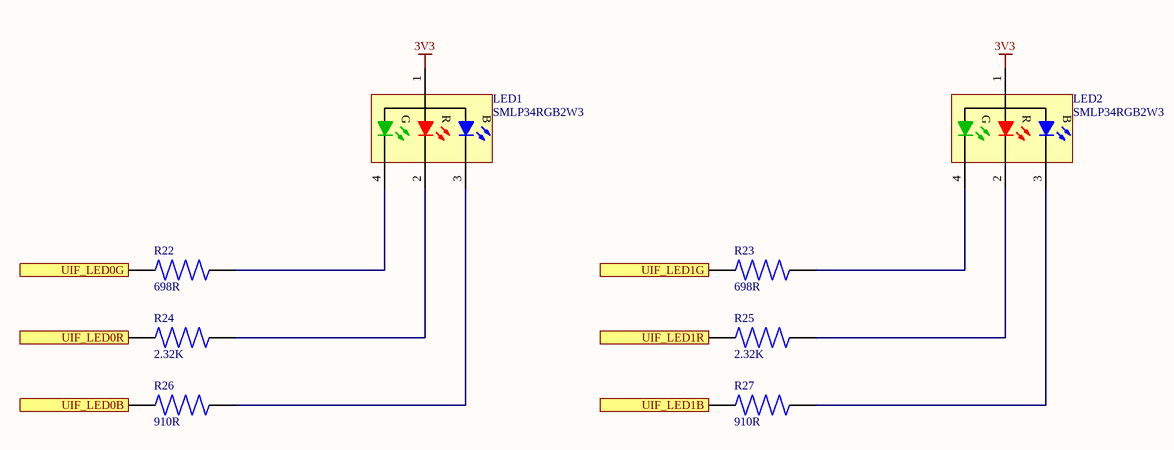
[diagram p8: LED.SchDoc]

### Parts
LED1  SMLP34RGB2W3  [ROHM-SMLP34-4_V]
LED2  SMLP34RGB2W3  [ROHM-SMLP34-4_V]
R22  698R  [R0603 Vishay]
R23  698R  [R0603 Vishay]
R24  2.32K  [R0805 Vishay]
R25  2.32K  [R0805 Vishay]
R26  910R  [R0402 Vishay]
R27  910R  [R0402 Vishay]

### Ports
UIF_LED0B (in), UIF_LED0G (in), UIF_LED0R (in), UIF_LED1B (in), UIF_LED1G (in), UIF_LED1R (in)

### Nets
3V3: LED1.1(A) LED2.1(A)
NetLED1_2: LED1.2(R) R24.2
NetLED1_3: LED1.3(B) R26.2
NetLED1_4: LED1.4(G) R22.2
NetLED2_2: LED2.2(R) R25.2
NetLED2_3: LED2.3(B) R27.2
NetLED2_4: LED2.4(G) R23.2
NetR22_1: R22.1 ; port UIF_LED0G
NetR23_1: R23.1 ; port UIF_LED1G
NetR24_1: R24.1 ; port UIF_LED0R
NetR25_1: R25.1 ; port UIF_LED1R
NetR26_1: R26.1 ; port UIF_LED0B
NetR27_1: R27.1 ; port UIF_LED1B

### Library data of the parts
LED1 LED2 = SMLP34RGB2W3: PICOLED-RGB LED, 5 mA, -40 to 85 degC, 4-Pin 1 x 1 x 0.25 mm SMD, RoHS, Tape and Reel; Manufacturer: ROHM Semiconductor; VR(RGB): 5 V; VF(Blue): 3.2 V Typ.; VF(Green): 3.3 V Typ.; IF(RGB): 5 mA; IR(RGB): 10 uA Max.; VF(Red): 2.2 V Typ.; ComponentLink1Description: Manufacturer URL; ComponentLink2Description: Datasheet; PartNumber: SMLP34RGB2W3; DatasheetVersion: Rev. G; Mounting Technology: Surface Mount; ComponentLink1URL: http://www.rohm.com/; Packing: Tape and Reel; RoHS: TRUE; Temperature Range: -40 to 85 degC; PackageReference: SMLP34; PackageDescription: 4-Pin SMD, Body 1 x 1 mm, Pitch 0.85 mm; ComponentLink2URL: http://rohmfs.rohm.com/en/products/databook/datasheet/opto/led/chip_multi/smlp34.pdf
R22 R23 = CRCW0201698RFNED: RES SMD 698 OHM 1% 1/20W 0201; Manufacturer: Vishay; Power Rating: 50mW; Voltage Rating: 30V; Temperature Coefficient: 200ppm/°C; Supplier 1: Digi-Key; Manufacturer Part Number: CRCW0201698RFNED; RoHS: Yes; Category: Chip SMD Resistors; Stock 1: 10000; Pricing 1: 1=0.10000, 10=0.05700, 100=0.02300, 1000=0.01034, 2500=0.00897, 5000=0.00741 (USD); Case/Package: 0201; Case Code (Metric): 0603; Case Code (Imperial): 0201; Contact Plating: Tin; Min Operating Temperature: -55°C; Max Operating Temperature: 155°C; Packaging: Tape and Reel; Resistance: 698R; Tolerance: 1%; Package Quantity: 10000; Resistor Type: Thick Film; Number of Terminations: 2; Max Power Dissipation: 50mW; Voltage Rating (DC): 30V; Length: 0.024inch; Width: 0.012inch; Height: 0.011inch; Radiation Hardening: No; REACH SVHC: Unknown; Lead Free: Lead Free; ComponentLink1URL: https://datasheet.ciiva.com/2577/crcw0201e3-2577171.pdf?src-supplier=Digi-Key; ComponentLink1Description: https://datasheet.ciiva.com/2577/crcw0201e3-2577171.pdf?src-supplier=Digi-Key; ComponentLink2URL: https://datasheet.ciiva.com/8922/crcw0201e3-8922646.pdf?src-supplier=Avnet; ComponentLink2Description: https://datasheet.ciiva.com/8922/crcw0201e3-8922646.pdf?src-supplier=Avnet; ComponentLink3URL: https://datasheet.ciiva.com/7672/1719906-7672440.pdf?src-supplier=Element14; ComponentLink3Description: https://datasheet.ciiva.com/7672/1719906-7672440.pdf?src-supplier=Element14; ComponentLink4URL: https://datasheet.ciiva.com/7672/1719906-7672441.pdf?src-supplier=Element14; ComponentLink4Description: https://datasheet.ciiva.com/7672/1719906-7672441.pdf?src-supplier=Element14; ComponentLink5URL: https://datasheet.ciiva.com/22674/1700795-22674828.pdf?src-supplier=Element14; ComponentLink5Description: https://datasheet.ciiva.com/22674/1700795-22674828.pdf?src-supplier=Element14; Supplier Part Number 1: 541-CRCW0201698RFNEDCT-ND
R24 R25 = CRCW08052K32FKEA: VISHAY - CRCW08052K32FKEA - RES, THICK FILM, 2K32, 1%, 0.125W, 0805; Resistance: 2.32kR; Temperature Coefficient: 100ppm/°C; Max Power Dissipation: 125mW; Voltage Rating: 150V; Supplier 1: Digi-Key; Manufacturer: Vishay; Manufacturer Part Number: CRCW08052K32FKEA; RoHS: Yes; Category: Chip SMD Resistors; Stock 1: 20040; Pricing 1: 1=0.10000, 10=0.05700, 100=0.02310, 1000=0.01039, 2500=0.00902 (USD); Case/Package: 0805; Number of Pins: 2; Contact Plating: Tin; Weight: 0.000194oz; Case Code (Imperial): 0805; Case Code (Metric): 2012; Min Operating Temperature: -55°C; Max Operating Temperature: 155°C; Tolerance: 1%; Resistor Type: Thick Film; Packaging: Tape and Reel; Number of Terminations: 2; Package Quantity: 10; Features: Automotive AEC-Q200; Power Rating: 125mW; Termination: SMD/SMT; Voltage Rating (DC): 150V; Length: 2mm; Width: 1.25mm; Height: 0.02inch; Depth: 1.25mm; Radiation Hardening: No; Lead Free: Lead Free; REACH SVHC: Unknown; Military Standard: Not; ComponentLink1URL: https://datasheet.ciiva.com/16435/dcrcwe3-16435909.pdf?src-supplier=Future+Electronics; ComponentLink1Description: https://datasheet.ciiva.com/16435/dcrcwe3-16435909.pdf?src-supplier=Future+Electronics; ComponentLink2URL: https://datasheet.ciiva.com/3258/dcrcwe3-3258438.pdf?src-supplier=Avnet; ComponentLink2Description: https://datasheet.ciiva.com/3258/dcrcwe3-3258438.pdf?src-supplier=Avnet; ComponentLink3URL: https://datasheet.ciiva.com/3258/dcrcwe3-3258439.pdf?src-supplier=Avnet; ComponentLink3Description: https://datasheet.ciiva.com/3258/dcrcwe3-3258439.pdf?src-supplier=Avnet; ComponentLink4URL: https://datasheet.ciiva.com/2525/dcrcwe3-2525755.pdf?src-supplier=Digi-Key; ComponentLink4Description: https://datasheet.ciiva.com/2525/dcrcwe3-2525755.pdf?src-supplier=Digi-Key; ComponentLink5URL: https://datasheet.ciiva.com/2525/dcrcwe3-2525756.pdf?src-supplier=Digi-Key; ComponentLink5Description: https://datasheet.ciiva.com/2525/dcrcwe3-2525756.pdf?src-supplier=Digi-Key; ComponentLink6URL: https://datasheet.ciiva.com/2525/dcrcwe3-2525757.pdf?src-supplier=Digi-Key; ComponentLink6Description: https://datasheet.ciiva.com/2525/dcrcwe3-2525757.pdf?src-supplier=Digi-Key; ComponentLink7URL: https://datasheet.ciiva.com/7670/1697337-7670286.pdf?src-supplier=Element14; ComponentLink7Description: https://datasheet.ciiva.com/7670/1697337-7670286.pdf?src-supplier=Element14; ComponentLink8URL: https://datasheet.ciiva.com/17201/dcrcwe3-17201132.pdf?src-supplier=Avnet+Europe; ComponentLink8Description: https://datasheet.ciiva.com/17201/dcrcwe3-17201132.pdf?src-supplier=Avnet+Europe; ComponentLink9URL: https://datasheet.ciiva.com/7670/1697337-7670285.pdf?src-supplier=Element14; ComponentLink9Description: https://datasheet.ciiva.com/7670/1697337-7670285.pdf?src-supplier=Element14; ComponentLink10URL: https://datasheet.ciiva.com/22675/1825492-22675197.pdf?src-supplier=Element14; ComponentLink10Description: https://datasheet.ciiva.com/22675/1825492-22675197.pdf?src-supplier=Element14; ComponentLink11URL: https://datasheet.ciiva.com/16769/70201119-16769374.pdf?src-supplier=Allied+Electronics; ComponentLink11Description: https://datasheet.ciiva.com/16769/70201119-16769374.pdf?src-supplier=Allied+Electronics; Supplier Part Number 1: 541-2.32KCCT-ND
R26 R27 = CRCW0402910RFKED: Res Thick Film 0402 910 Ohm 1% 0.063W(1/16W) ±100ppm/C Pad SMD Automotive T/R; Manufacturer: Vishay; Temperature Coefficient: 100ppm/°C; Power Rating: 63mW; Voltage Rating: 50V; Supplier 1: Digi-Key; Manufacturer Part Number: CRCW0402910RFKED; RoHS: Yes; Category: Chip SMD Resistors; Stock 1: 32719; Pricing 1: 1=0.10000, 10=0.03300, 100=0.01330, 1000=0.00596, 2500=0.00518, 5000=0.00428 (USD); Case/Package: 0402; Contact Plating: Tin; Weight: 2.3E-05oz; Case Code (Imperial): 0402; Case Code (Metric): 1005; Min Operating Temperature: -55°C; Max Operating Temperature: 155°C; Resistance: 910R; Tolerance: 1%; Resistor Type: Thick Film; Packaging: Tape and Reel; Package Quantity: 10; Termination: SMD/SMT; Number of Terminations: 2; Max Power Dissipation: 63mW; Features: Automotive AEC-Q200; Voltage Rating (DC): 50V; Length: 1mm; Width: 0.5mm; Height: 0.35mm; Depth: 0.5mm; Radiation Hardening: No; Lead Free: Lead Free; REACH SVHC: Unknown; Military Standard: Not; ComponentLink1URL: https://datasheet.ciiva.com/11818/0900766b80d98824-11818156.pdf?src-supplier=RSComponents; ComponentLink1Description: https://datasheet.ciiva.com/11818/0900766b80d98824-11818156.pdf?src-supplier=RSComponents; ComponentLink2URL: https://datasheet.ciiva.com/5545/dcrcwe3-109170-5545657.pdf?src-supplier=Mouser; ComponentLink2Description: https://datasheet.ciiva.com/5545/dcrcwe3-109170-5545657.pdf?src-supplier=Mouser; ComponentLink3URL: https://datasheet.ciiva.com/22674/1847332-22674841.pdf?src-supplier=Element14; ComponentLink3Description: https://datasheet.ciiva.com/22674/1847332-22674841.pdf?src-supplier=Element14; ComponentLink4URL: https://datasheet.ciiva.com/2463/dcrcwe3-2463999.pdf?src-supplier=Digi-Key; ComponentLink4Description: https://datasheet.ciiva.com/2463/dcrcwe3-2463999.pdf?src-supplier=Digi-Key; ComponentLink5URL: https://datasheet.ciiva.com/7672/1697337-7672517.pdf?src-supplier=Element14; ComponentLink5Description: https://datasheet.ciiva.com/7672/1697337-7672517.pdf?src-supplier=Element14; ComponentLink6URL: https://datasheet.ciiva.com/16778/70201119-16778533.pdf?src-supplier=Allied+Electronics; ComponentLink6Description: https://datasheet.ciiva.com/16778/70201119-16778533.pdf?src-supplier=Allied+Electronics; ComponentLink7URL: https://datasheet.ciiva.com/16426/dcrcwe3-16426299.pdf?src-supplier=Future+Electronics; ComponentLink7Description: https://datasheet.ciiva.com/16426/dcrcwe3-16426299.pdf?src-supplier=Future+Electronics; ComponentLink8URL: https://datasheet.ciiva.com/22706/1697337-22706347.pdf?src-supplier=Element14; ComponentLink8Description: https://datasheet.ciiva.com/22706/1697337-22706347.pdf?src-supplier=Element14; ComponentLink9URL: https://datasheet.ciiva.com/2463/dcrcwe3-2463997.pdf?src-supplier=Digi-Key; ComponentLink9Description: https://datasheet.ciiva.com/2463/dcrcwe3-2463997.pdf?src-supplier=Digi-Key; ComponentLink10URL: https://datasheet.ciiva.com/2463/dcrcwe3-2463998.pdf?src-supplier=Digi-Key; ComponentLink10Description: https://datasheet.ciiva.com/2463/dcrcwe3-2463998.pdf?src-supplier=Digi-Key; ComponentLink11URL: https://datasheet.ciiva.com/7672/1697337-7672518.pdf?src-supplier=Element14; ComponentLink11Description: https://datasheet.ciiva.com/7672/1697337-7672518.pdf?src-supplier=Element14; Supplier Part Number 1: 541-910LCT-ND